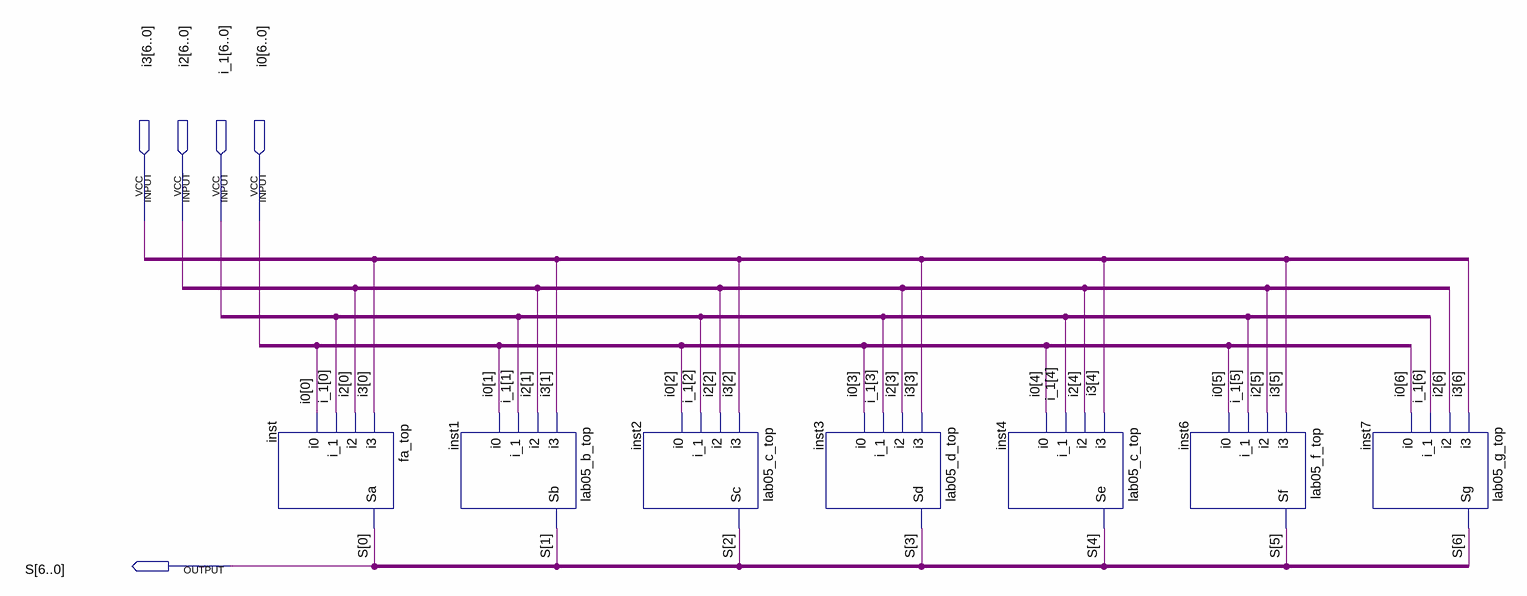
[diagram p0: schematic sheet]
// Quartus schematic project_led_top.bdf as structural Verilog: 7 symbols, 5 pins
module project_led_top (
  input  [6:0] i3,
  input  [6:0] i2,
  input  [6:0] i_1,
  input  [6:0] i0,
  output [6:0] S
);

  fa_top inst (.i3(i3[0]), .i2(i2[0]), .i_1(i_1[0]), .i0(i0[0]), .Sa(S[0]));
  lab05_b_top inst1 (.i3(i3[1]), .i2(i2[1]), .i_1(i_1[1]), .i0(i0[1]), .Sb(S[1]));
  lab05_c_top inst2 (.i3(i3[2]), .i2(i2[2]), .i_1(i_1[2]), .i0(i0[2]), .Sc(S[2]));
  lab05_d_top inst3 (.i3(i3[3]), .i2(i2[3]), .i_1(i_1[3]), .i0(i0[3]), .Sd(S[3]));
  lab05_c_top inst4 (.i3(i3[4]), .i2(i2[4]), .i_1(i_1[4]), .i0(i0[4]), .Se(S[4]));
  lab05_f_top inst6 (.i3(i3[5]), .i2(i2[5]), .i_1(i_1[5]), .i0(i0[5]), .Sf(S[5]));
  lab05_g_top inst7 (.i3(i3[6]), .i2(i2[6]), .i_1(i_1[6]), .i0(i0[6]), .Sg(S[6]));
endmodule
